# Altium schematic sheet [3]-Digital Input.SchDoc
size A2; DocumentNumber: 3; SheetNumber: 3; SheetTotal: 5
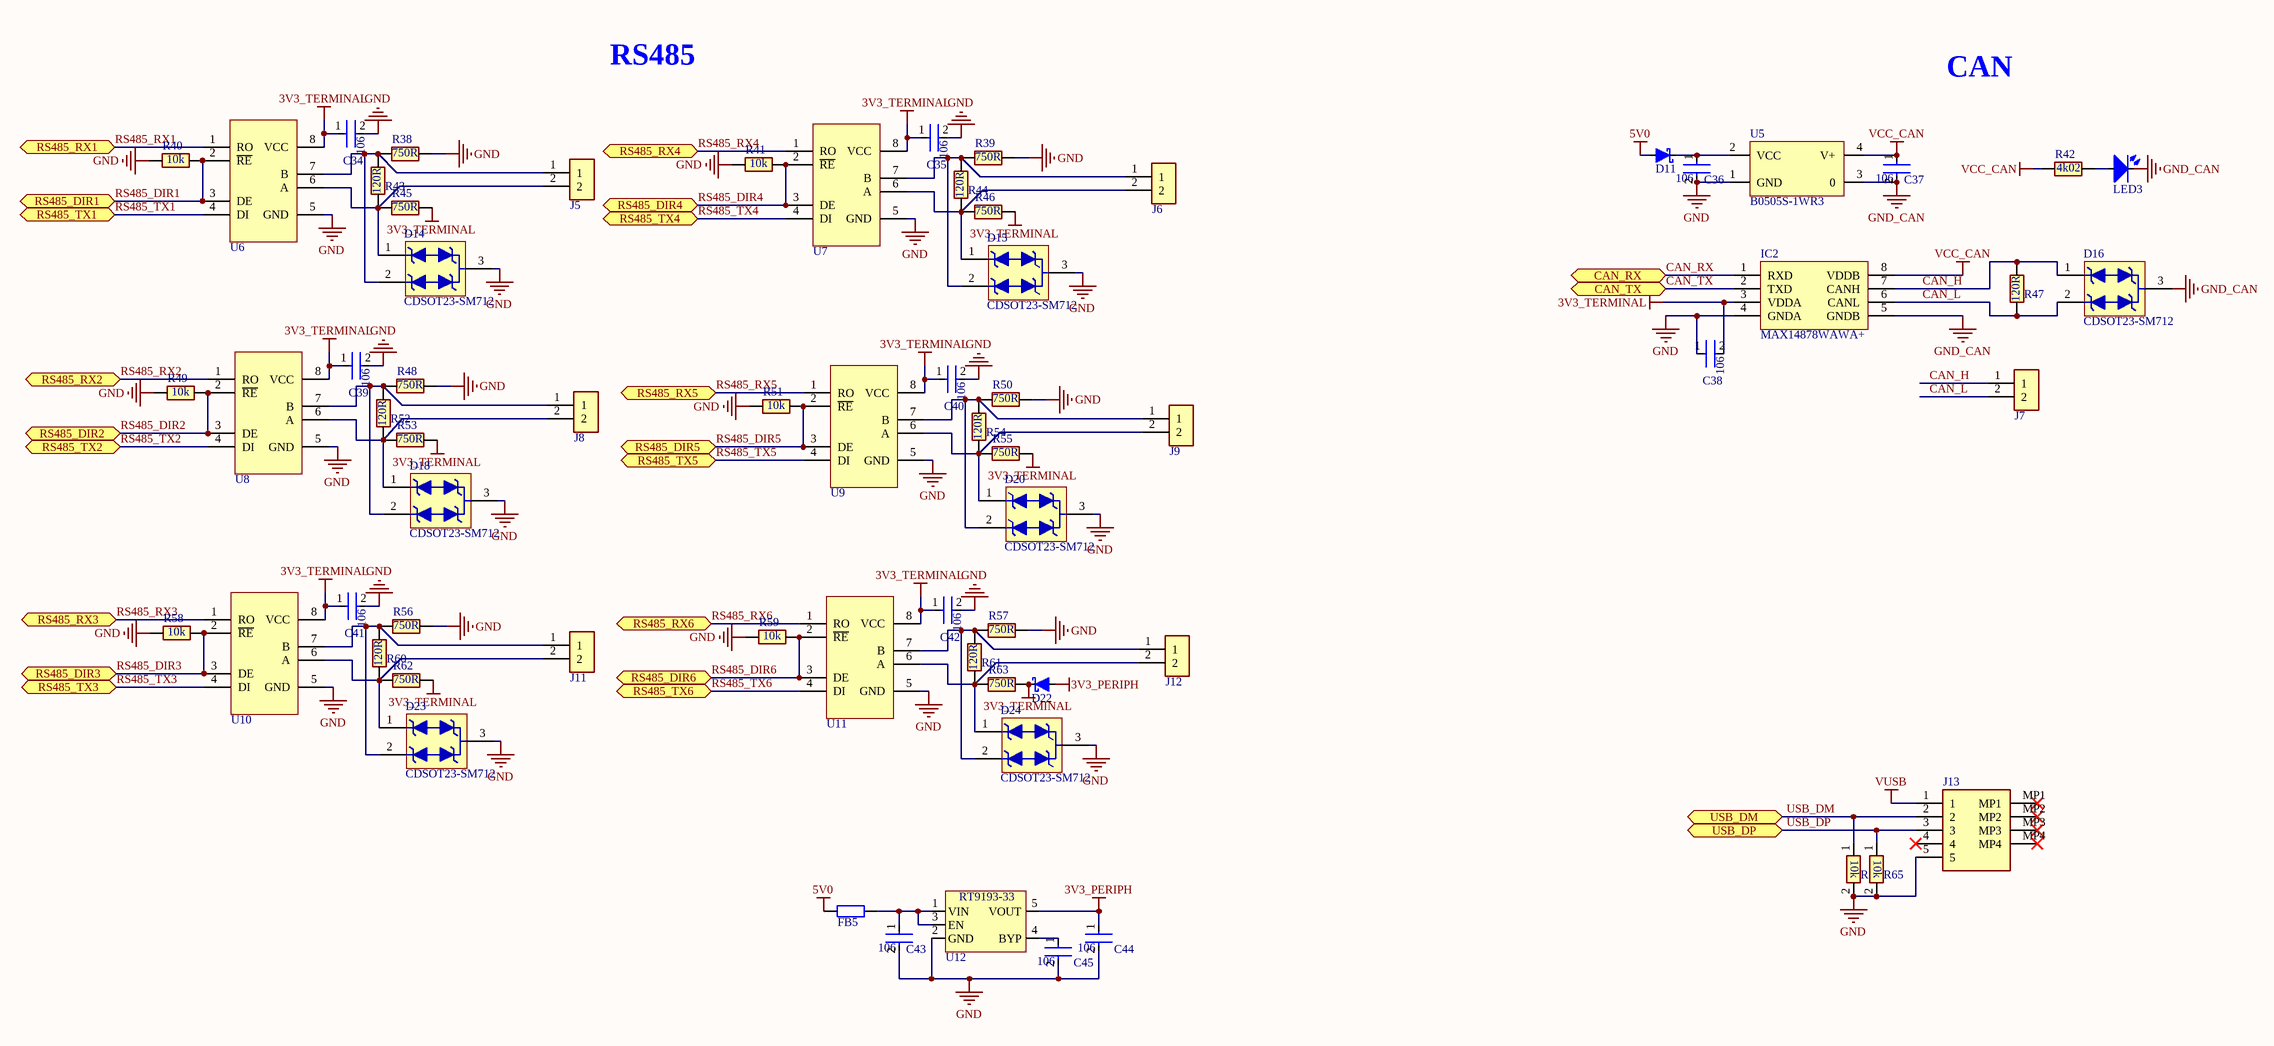
[diagram p0: [3]-Digital Input.SchDoc]

## Parts
C34  C0603_106_35V  [C0603]  (value not drawn)
C35  C0603_106_35V  [C0603]  (value not drawn)
C36  C0603_106_35V  [C0603]  (value not drawn)
C37  C0603_106_35V  [C0603]  (value not drawn)
C38  C0603_106_35V  [C0603]  (value not drawn)
C39  C0603_106_35V  [C0603]  (value not drawn)
C40  C0603_106_35V  [C0603]  (value not drawn)
C41  C0603_106_35V  [C0603]  (value not drawn)
C42  C0603_106_35V  [C0603]  (value not drawn)
C43  C0603_106_35V  [C0603]  (value not drawn)
C44  C0603_106_35V  [C0603]  (value not drawn)
C45  C0603_106_35V  [C0603]  (value not drawn)
D11  PMEG40T30ERX  [SOD123]  (value not drawn)
D14  CDSOT23-SM712  [SOT-23]
D15  CDSOT23-SM712  [SOT-23]
D16  CDSOT23-SM712  [SOT-23]
D18  CDSOT23-SM712  [SOT-23]
D20  CDSOT23-SM712  [SOT-23]
D22  PMEG40T30ERX  [SOD123]  (value not drawn)
D23  CDSOT23-SM712  [SOT-23]
D24  CDSOT23-SM712  [SOT-23]
FB5  FERRIT_0805_1A  [FB0805]  (value not drawn)
IC2  MAX14878WAWA+  [8-SOIC-W]
J5  Terminal_2P_5.08mm  [1729128]  (value not drawn)
J6  Terminal_2P_5.08mm  [1729128]  (value not drawn)
J7  Terminal_2P_5.08mm  [1729128]  (value not drawn)
J8  Terminal_2P_5.08mm  [1729128]  (value not drawn)
J9  Terminal_2P_5.08mm  [1729128]  (value not drawn)
J11  Terminal_2P_5.08mm  [1729128]  (value not drawn)
J12  Terminal_2P_5.08mm  [1729128]  (value not drawn)
J13  1734035-3  [17340353]  (value not drawn)
LED3  LED0603_Blue  [LED0603]  (value not drawn)
R38  R0603_750R  [RES-SMD-0603]  (value not drawn)
R39  R0603_750R  [RES-SMD-0603]  (value not drawn)
R40  R0603_10k  [RES-SMD-0603]  (value not drawn)
R41  R0603_10k  [RES-SMD-0603]  (value not drawn)
R42  R0603_4k02  [RES-SMD-0603]  (value not drawn)
R43  R0603_120R  [RES-SMD-0603]  (value not drawn)
R44  R0603_120R  [RES-SMD-0603]  (value not drawn)
R45  R0603_750R  [RES-SMD-0603]  (value not drawn)
R46  R0603_750R  [RES-SMD-0603]  (value not drawn)
R47  R0603_120R  [RES-SMD-0603]  (value not drawn)
R48  R0603_750R  [RES-SMD-0603]  (value not drawn)
R49  R0603_10k  [RES-SMD-0603]  (value not drawn)
R50  R0603_750R  [RES-SMD-0603]  (value not drawn)
R51  R0603_10k  [RES-SMD-0603]  (value not drawn)
R52  R0603_120R  [RES-SMD-0603]  (value not drawn)
R53  R0603_750R  [RES-SMD-0603]  (value not drawn)
R54  R0603_120R  [RES-SMD-0603]  (value not drawn)
R55  R0603_750R  [RES-SMD-0603]  (value not drawn)
R56  R0603_750R  [RES-SMD-0603]  (value not drawn)
R57  R0603_750R  [RES-SMD-0603]  (value not drawn)
R58  R0603_10k  [RES-SMD-0603]  (value not drawn)
R59  R0603_10k  [RES-SMD-0603]  (value not drawn)
R60  R0603_120R  [RES-SMD-0603]  (value not drawn)
R61  R0603_120R  [RES-SMD-0603]  (value not drawn)
R62  R0603_750R  [RES-SMD-0603]  (value not drawn)
R63  R0603_750R  [RES-SMD-0603]  (value not drawn)
R64  R0603_10k  [RES-SMD-0603]  (value not drawn)
R65  R0603_10k  [RES-SMD-0603]  (value not drawn)
U5  B0505S-1WR3  [B0505S-1WR3]
U6  MAX3485  [8-SOIC]  (value not drawn)
U7  MAX3485  [8-SOIC]  (value not drawn)
U8  MAX3485  [8-SOIC]  (value not drawn)
U9  MAX3485  [8-SOIC]  (value not drawn)
U10  MAX3485  [8-SOIC]  (value not drawn)
U11  MAX3485  [8-SOIC]  (value not drawn)
U12  RT9193-33GB  [SOT-23-5]  (value not drawn)

## Ports
CAN_RX (bidir), CAN_TX (bidir), RS485_DIR1 (bidir), RS485_DIR2 (bidir), RS485_DIR3 (bidir), RS485_DIR4 (bidir), RS485_DIR5 (bidir), RS485_DIR6 (bidir), RS485_RX1 (bidir), RS485_RX2 (bidir), RS485_RX3 (bidir), RS485_RX4 (bidir), RS485_RX5 (bidir), RS485_RX6 (bidir), RS485_TX1 (bidir), RS485_TX2 (bidir), RS485_TX3 (bidir), RS485_TX4 (bidir), RS485_TX5 (bidir), RS485_TX6 (bidir), USB_DM (bidir), USB_DP (bidir)

## Nets
3V3_PERIPH: C44.1 D22.1(A) U12.5(VOUT)
3V3_TERMINAL: C34.1 C35.1 C38.2 C39.1 C40.1 C41.1 C42.1 D22.2(K) IC2.3(VDDA) R45.2 R46.2 R53.2 R55.2 R62.2 R63.2 U6.8(VCC) U7.8(VCC) U8.8(VCC) U9.8(VCC) U10.8(VCC) U11.8(VCC)
5V0: D11.1(A) FB5.1
GND: C34.2 C35.2 C36.2 C38.1 C39.2 C40.2 C41.2 C42.2 C43.2 C44.2 C45.2 D14.3 D15.3 D18.3 D20.3 D23.3 D24.3 IC2.4(GNDA) J13.5 R38.2 R39.2 R40.1 R41.1 R48.2 R49.1 R50.2 R51.1 R56.2 R57.2 R58.1 R59.1 R64.2 R65.2 U5.1(GND) U6.5(GND) U7.5(GND) U8.5(GND) U9.5(GND) U10.5(GND) U11.5(GND) U12.2(GND)
GND_CAN: C37.2 D16.3 IC2.5(GNDB) LED3.1(K) U5.3(0)
VCC_CAN: C37.1 IC2.8(VDDB) R42.1 U5.4(V+)
VUSB: J13.1
CAN_H: D16.1 IC2.7(CANH) J7.1 R47.2
CAN_L: D16.2 IC2.6(CANL) J7.2 R47.1
CAN_RX: IC2.1(RXD) ; port CAN_RX
CAN_TX: IC2.2(TXD) ; port CAN_TX
RS485_DIR1: R40.2 U6.2(~{RE}) U6.3(DE) ; port RS485_DIR1
RS485_DIR2: R49.2 U8.2(~{RE}) U8.3(DE) ; port RS485_DIR2
RS485_DIR3: R58.2 U10.2(~{RE}) U10.3(DE) ; port RS485_DIR3
RS485_DIR4: R41.2 U7.2(~{RE}) U7.3(DE) ; port RS485_DIR4
RS485_DIR5: R51.2 U9.2(~{RE}) U9.3(DE) ; port RS485_DIR5
RS485_DIR6: R59.2 U11.2(~{RE}) U11.3(DE) ; port RS485_DIR6
RS485_RX1: U6.1(RO) ; port RS485_RX1
RS485_RX2: U8.1(RO) ; port RS485_RX2
RS485_RX3: U10.1(RO) ; port RS485_RX3
RS485_RX4: U7.1(RO) ; port RS485_RX4
RS485_RX5: U9.1(RO) ; port RS485_RX5
RS485_RX6: U11.1(RO) ; port RS485_RX6
RS485_TX1: U6.4(DI) ; port RS485_TX1
RS485_TX2: U8.4(DI) ; port RS485_TX2
RS485_TX3: U10.4(DI) ; port RS485_TX3
RS485_TX4: U7.4(DI) ; port RS485_TX4
RS485_TX5: U9.4(DI) ; port RS485_TX5
RS485_TX6: U11.4(DI) ; port RS485_TX6
USB_DM: J13.2 R64.1 ; port USB_DM
USB_DP: J13.3 R65.1 ; port USB_DP
NetC36_1: C36.1 D11.2(K) U5.2(VCC)
NetC43_1: C43.1 FB5.2 U12.1(VIN) U12.3(EN)
NetC45_1: C45.1 U12.4(BYP)
NetD14_1: D14.1 J5.2 R43.1 R45.1 U6.6(A)
NetD14_2: D14.2 J5.1 R38.1 R43.2 U6.7(B)
NetD15_1: D15.1 J6.2 R44.1 R46.1 U7.6(A)
NetD15_2: D15.2 J6.1 R39.1 R44.2 U7.7(B)
NetD18_1: D18.1 J8.2 R52.1 R53.1 U8.6(A)
NetD18_2: D18.2 J8.1 R48.1 R52.2 U8.7(B)
NetD20_1: D20.1 J9.2 R54.1 R55.1 U9.6(A)
NetD20_2: D20.2 J9.1 R50.1 R54.2 U9.7(B)
NetD23_1: D23.1 J11.2 R60.1 R62.1 U10.6(A)
NetD23_2: D23.2 J11.1 R56.1 R60.2 U10.7(B)
NetD24_1: D24.1 J12.2 R61.1 R63.1 U11.6(A)
NetD24_2: D24.2 J12.1 R57.1 R61.2 U11.7(B)
NetLED3_2: LED3.2(A) R42.2

Not connected (* = marked no-connect by the designer): J13 4* MP1* MP2* MP3* MP4*

## Notes on the sheet
- RS485
- CAN
- Sửa đổi
- 1
- Miêu tả
- CHỈNH SỬA
- Khu vực
- Thời gian
- 2
- 3
- 4
- THIẾT KẾ:
- Họ Tên
- Chữ ký
- Ngày ký
- TỔNG CÔNG TY CÔNG NGHIỆP CNC VIETTEL
- TRUNG TÂM CN CK & TĐH
- Mã dự án
- XUẤT BẢN VẼ:
- Bản vẽ thiết kế sơ đồ nguyên lý
- KHỐI 1
- Mã thiết bị
- KIỂM TRA:
- Mã bản vẽ
- Mã phiên bản
- Kích thước
- Trang
- PHÊ DUYỆT:
- Tên file:
- A2
- (in symbol C0603_106_35V) 106
- (in symbol R0603_4k02) 4k02
- (in symbol R0603_10k) 10k
- (in symbol R0603_120R) 120R
- (in symbol R0603_750R) 750R
- (in symbol RT9193-33GB) RT9193-33

## Library data of the parts
C34-C45 = C0603_106_35V: Multilayer Ceramic Capacitors MLCC - SMD/SMT 10 uF 35 VDC 20% 0603 X5R; Manufacturer_Name: Murata Electronics; Manufacturer_Part_Number: GRM188R6YA106MA73J; Datasheet Link: http://componentsearchengine.com/Datasheets/1/GRM188R6YA106MA73J.pdf; Height: 0.9mm; Mouser Part Number: 81-GRM188R6YA106MA3J; Mouser Price/Stock: https://www.mouser.co.uk/ProductDetail/Murata-Electronics/GRM188R6YA106MA73J?qs=5aG0NVq1C4xLSwNPdfnaYg%3D%3D; Arrow Part Number: GRM188R6YA106MA73J; Arrow Price/Stock: https://www.arrow.com/en/products/grm188r6ya106ma73j/murata-manufacturing?region=europe
D11 D22 = PMEG40T30ERX: Schottky Diode 40V 3A; Manufacturer_Name: Nexperia; Datasheet Link: https://assets.nexperia.com/documents/data-sheet/PMEG40T30ER.pdf; Height: 1.1mm; Manufacturer_Part_Number: PMEG40T30ERX; Mouser Part Number: 771-PMEG40T30ERX; Mouser Price/Stock: https://www.mouser.co.uk/ProductDetail/Nexperia/PMEG40T30ERX?qs=1mbolxNpo8eeG%2Fr5KLvXLA%3D%3D; Arrow Part Number: PMEG40T30ERX; Arrow Price/Stock: https://www.arrow.com/en/products/pmeg40t30erx/nexperia?region=europe
D14-D16 D18 D20 D23 D24 = CDSOT23-SM712: Manufacturer: Bourns Inc.; Info: TVS DIODE 7V/12V 14V/26V SOT23-3; Part Number: CDSOT23-SM712; Temperature: -55°C ~ 150°C (TJ); URL: https://www.digikey.com/product-detail/en/bourns-inc/CDSOT23-SM712/CDSOT23-SM712CT-ND/1630607; Price: 1.49
FB5 = FERRIT_0805_1A: Manufacturer: Laird-Signal Integrity Products; Part Number: MI0805J102R-10; info: FERRITE BEAD 1 KOHM 0805 1LN; Temperature: -40°C ~ 125°C; URL: https://www.digikey.com/en/products/detail/laird-signal-integrity-products/MI0805J102R-10/1015975; Price: 0.2; Manufacturer Part Number: MI0805J102R-10
IC2 = MAX14878WAWA+: Integrated Circuit; Manufacturer_Name: Analog Devices; Datasheet Link: https://datasheets.maximintegrated.com/en/ds/MAX14878-MAX14880.pdf; Height: 2.65mm; Manufacturer_Part_Number: MAX14878WAWA+; Mouser Part Number: 700-MAX14878WAWA+; Mouser Price/Stock: https://www.mouser.co.uk/ProductDetail/Maxim-Integrated/MAX14878WAWA%2b?qs=zW32dvEIR3sEVkmu8Yl9AA%3D%3D
J5-J9 J11 J12 = Terminal_2P_5.08mm: Fixed Terminal Blocks 2P 5.08mm 90DEG; Manufacturer_Name: Phoenix Contact; Datasheet Link: http://www.phoenixcontact.net/product/1729128; Height: 10.15mm; Manufacturer_Part_Number: 1729128; Mouser Part Number: 651-1729128; Mouser Price/Stock: https://www.mouser.co.uk/ProductDetail/Phoenix-Contact/1729128?qs=GFUSqQMLmmnCBVBY3dts9w%3D%3D; Arrow Part Number: 1729128; Arrow Price/Stock: https://www.arrow.com/en/products/1729128/phoenix-contact?region=nac
J13 = 1734035-3: Connector; Manufacturer_Name: TE Connectivity; Datasheet Link: https://www.te.com/commerce/DocumentDelivery/DDEController?Action=srchrtrv&DocNm=1654270-2&DocType=Catalog%20Section&DocLang=English&PartCntxt=1734035-3&DocFormat=pdf; Height: 3.95mm; Manufacturer_Part_Number: 1734035-3; Mouser Part Number: 571-1734035-3; Mouser Price/Stock: https://www.mouser.co.uk/ProductDetail/TE-Connectivity/1734035-3?qs=JQ0T48ZyHbB%2Fl8a%2FPKP6Xw%3D%3D; Arrow Part Number: 1734035-3; Arrow Price/Stock: https://www.arrow.com/en/products/1734035-3/te-connectivity?region=nac
LED3 = LED0603_Blue: Blue 470nm LED Indication - Discrete 3.2V 0603 (1608 Metric); Manufacturer_Name: Wurth Elektronik; Manufacturer_Part_Number: 150060BS75000; Datasheet Link: https://componentsearchengine.com/Datasheets/2/150060BS75000.pdf; Height: 0.8mm; Mouser Part Number: 710-150060BS75000; Mouser Price/Stock: https://www.mouser.co.uk/ProductDetail/Wurth-Elektronik/150060BS75000?qs=LlUlMxKIyB2DLLpXQThavA%3D%3D
R38 R39 R45 R46 R48 R50 R53 R55-R57 R62 R63 = R0603_750R: Resistor; Manufacturer_Name: Panasonic; Manufacturer_Part_Number: ERJ-3EKF7500V; Datasheet Link: http://industrial.panasonic.com/cdbs/www-data/pdf/RDA0000/AOA0000C86.pdf; Height: 0.55mm; Mouser Part Number: 667-ERJ-3EKF7500V; Mouser Price/Stock: https://www.mouser.co.uk/ProductDetail/Panasonic/ERJ-3EKF7500V?qs=W%252B6c3YqutMuhUZCITjFq0Q%3D%3D; Arrow Part Number: ERJ-3EKF7500V; Arrow Price/Stock: https://www.arrow.com/en/products/erj-3ekf7500v/panasonic?region=nac
R40 R41 R49 R51 R58 R59 R64 R65 = R0603_10k: Thick Film Resistors - SMD 0603 10Kohms 1% AEC-Q200; Manufacturer_Name: Panasonic; Manufacturer_Part_Number: ERJ-3EKF1002V; Datasheet Link: http://industrial.panasonic.com/cdbs/www-data/pdf/RDA0000/AOA0000C86.pdf; Height: 0.55mm; Mouser Part Number: 667-ERJ-3EKF1002V; Mouser Price/Stock: https://www.mouser.co.uk/ProductDetail/Panasonic/ERJ-3EKF1002V?qs=H7k1u0Mp9JSrGPQ5%2F5COuw%3D%3D; Arrow Part Number: ERJ-3EKF1002V; Arrow Price/Stock: https://www.arrow.com/en/products/erj-3ekf1002v/panasonic?region=europe
R42 = R0603_4k02: Resistor; Manufacturer_Name: Panasonic; Manufacturer_Part_Number: ERJ-3EKF4021V; Datasheet Link: http://industrial.panasonic.com/cdbs/www-data/pdf/RDA0000/AOA0000C86.pdf; Height: 0.55mm; Mouser Part Number: 667-ERJ-3EKF4021V; Mouser Price/Stock: https://www.mouser.com/Search/Refine.aspx?Keyword=667-ERJ-3EKF4021V; Arrow Part Number: ERJ-3EKF4021V; Arrow Price/Stock: https://www.arrow.com/en/products/erj-3ekf4021v/panasonic
R43 R44 R47 R52 R54 R60 R61 = R0603_120R: Thick Film Resistors - SMD 0603 120ohms 1% AEC-Q200; Manufacturer_Name: Panasonic; Manufacturer_Part_Number: ERJ-3EKF1200V; Datasheet Link: http://industrial.panasonic.com/cdbs/www-data/pdf/RDA0000/AOA0000C86.pdf; Height: 0.55mm; Mouser Part Number: 667-ERJ-3EKF1200V; Mouser Price/Stock: https://www.mouser.co.uk/ProductDetail/Panasonic/ERJ-3EKF1200V?qs=iBwFsHVUAOfkZ4Bj0qjBGg%3D%3D; Arrow Part Number: ERJ-3EKF1200V; Arrow Price/Stock: https://www.arrow.com/en/products/erj-3ekf1200v/panasonic?region=nac
U5 = B0505S-1WR3: Manufacturer: Mornsun America, LLC; Info: Isolated Module DC DC Converter 1 Output 5V - - - 200mA 4.5V - 5.5V Input; Part Number: B0505S-1WR3; Temperature: -40°C ~ 105°C; URL: https://www.digikey.com/en/products/detail/mornsun-america-llc/B0505S-1WR3/13168098?s=N4IgTCBcDaIEIAYCsyDKBaAjAdQEoGYQBdAXyA; Price: 5.23; Manufacturer Part Number: B0505S-1WR3
U6-U11 = MAX3485: Manufacturer: Maxim Integrated; Part Number: MAX3485EESA+; info: IC TRANSCEIVER HALF 1/1 8SOIC; Temperature: -40°C ~ 85°C; URL: https://www.digikey.com/product-detail/en/maxim-integrated/MAX3485EESA/MAX3485EESA-ND/1702243; Price: 3.91
U12 = RT9193-33GB: Linear Voltage Regulator IC Positive Fixed 1 Output 300mA SOT-23-5; Manufacturer: Richtek USA Inc.; info: IC REG LINEAR 3.3V 300MA SOT23-5; Part Number: RT9193-33GB; Temperature: -40°C ~ 125°C; URL: https://www.digikey.com/en/products/detail/richtek-usa-inc/RT9193-33GB/2470048?s=N4IgTCBcDaIEoBUCcBGJBmAtO9BxAQiALoC%2BQA; Price: 0.56; Type: IC; Manufacturer Part Number: RT9193-33GB